# EAGLE design DigitalPSU (EAGLE 7.3.0)
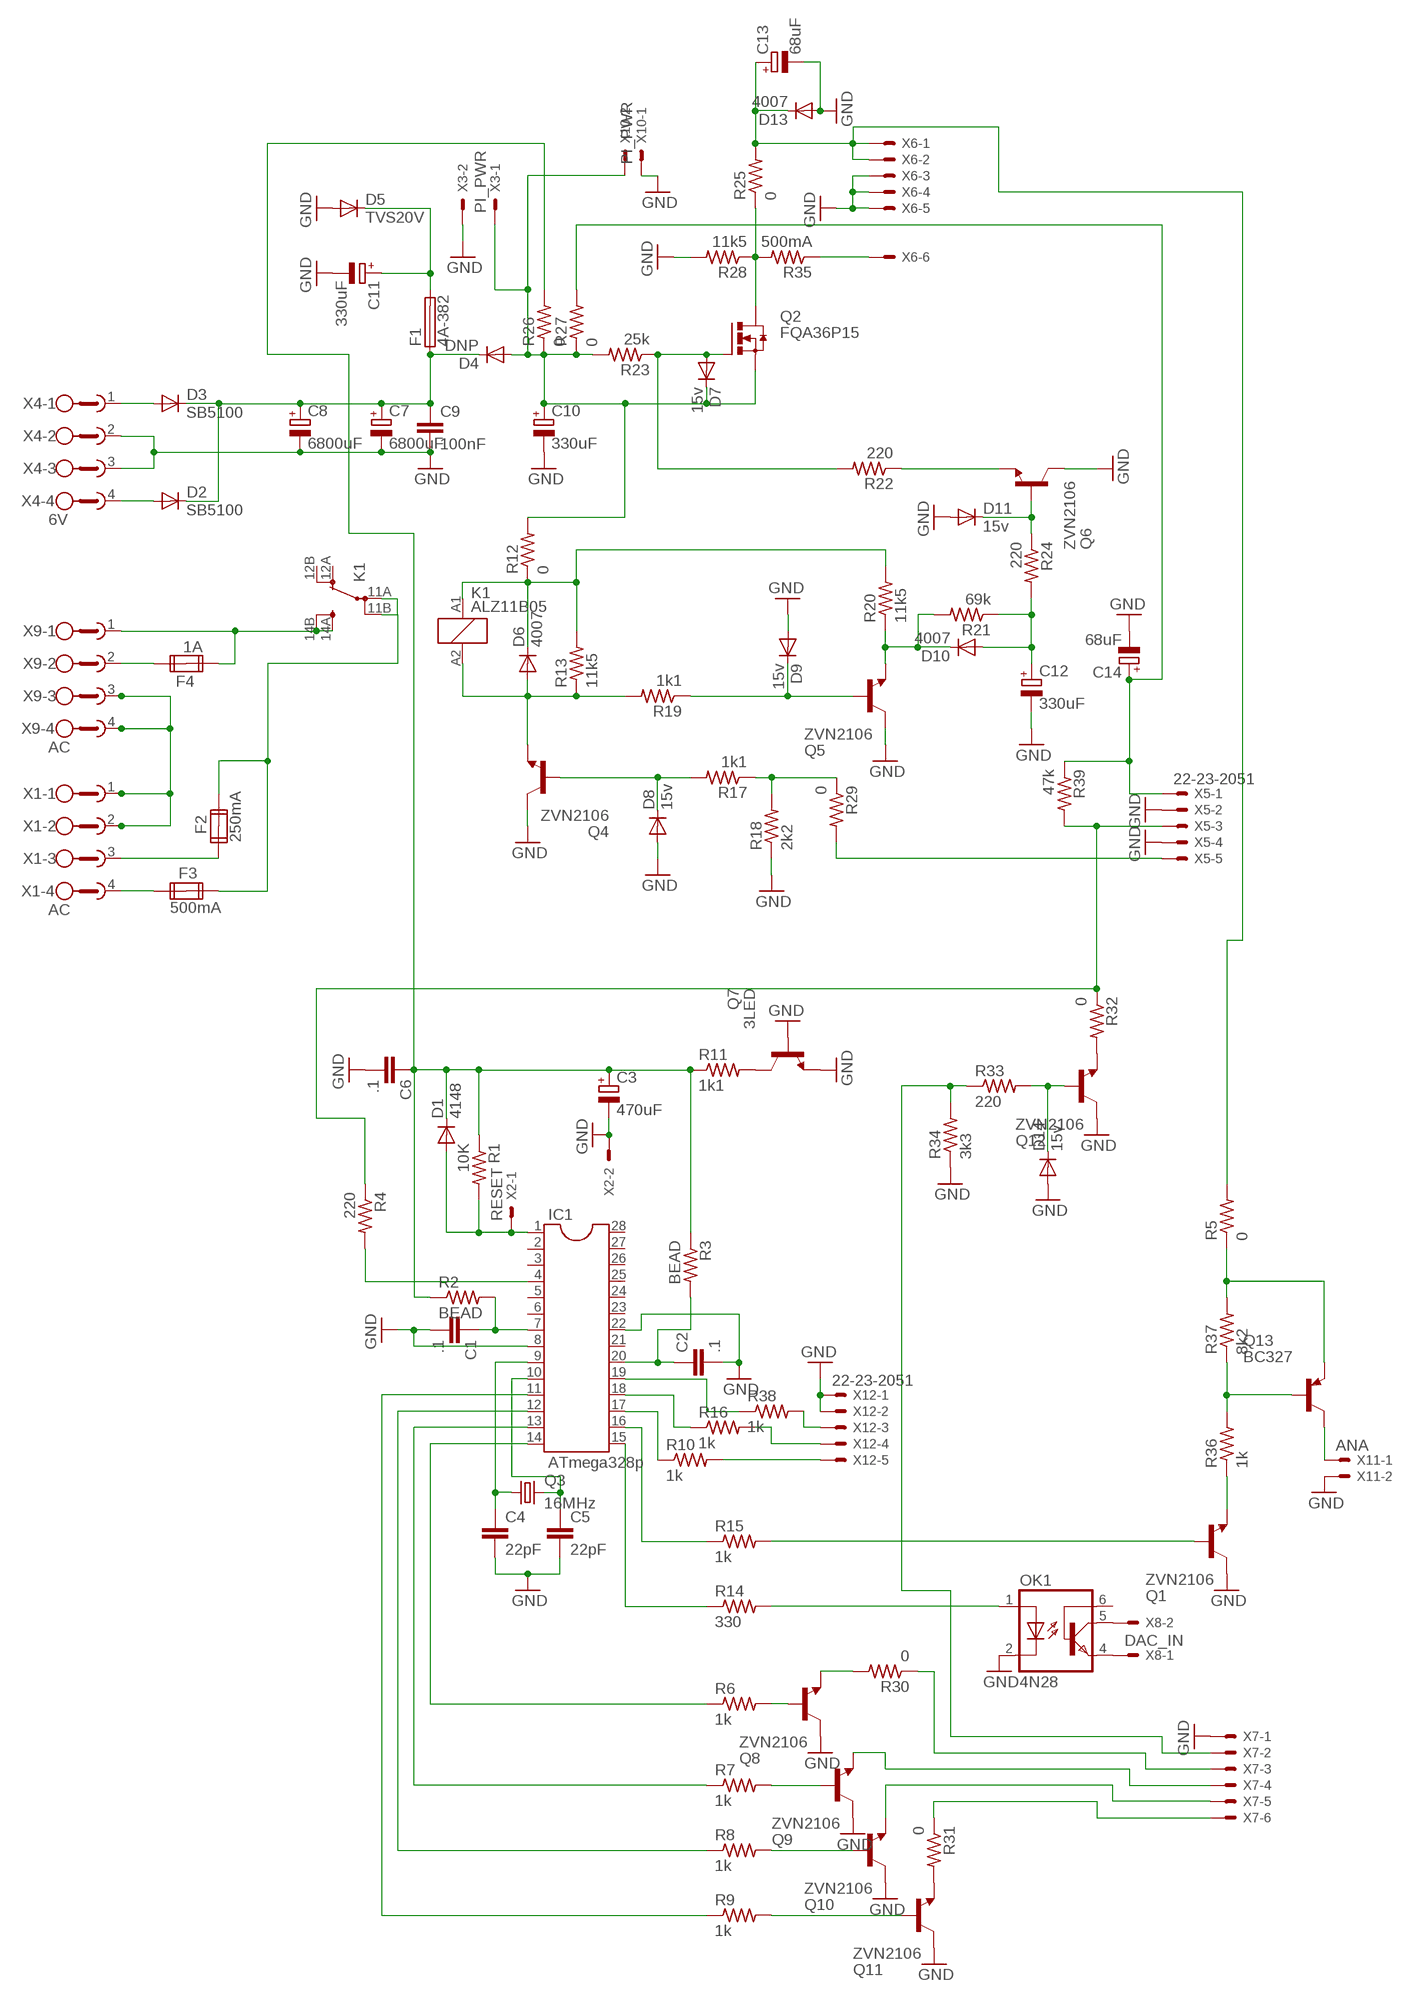
[diagram p0: schematic, sheet 1]

## Parts
C1  .1  C-EUC1210K  [C1210K]
C2  .1  C-EUC1210K  [C1210K]
C3  470uF  CPOL-EUE3.5-10  [E3,5-10]
C4  22pF  C-EUC1210K  [C1210K]
C5  22pF  C-EUC1210K  [C1210K]
C6  .1  C-EUC1210K  [C1210K]
C7  6800uF  CPOL-EUE10-20  [EB20D]
C8  6800uF  CPOL-EUE10-20  [EB20D]
C9  100nF  C10/6  [C10B6]
C10  330uF  CPOL-EUE3.5-10  [E3,5-10]
C11  330uF  CPOL-EUE3.5-10  [E3,5-10]
C12  330uF  CPOL-EUE3.5-10  [E3,5-10]
C13  68uF  CPOL-EUE3.5-10  [E3,5-10]
C14  68uF  CPOL-EUE3.5-10  [E3,5-10]
D1  4148  1N4148DO35-7  [DO35-7]
D2  SB5100  BY448  [SOD57-10]
D3  SB5100  BY448  [SOD57-10]
D4  DNP  1N4004  [DO41-10]
D5  TVS20V  BY448  [SOD57-10]
D6  4007  1N4004  [DO41-10]
D7  15v  1N4148DO35-10  [DO35-10]
D8  15v  1N4148DO35-7  [DO35-7]
D9  15v  1N4148DO35-7  [DO35-7]
D10  4007  1N4148DO35-10  [DO35-10]
D11  15v  1N4148DO35-7  [DO35-7]
D13  4007  1N4004  [DO41-10]
D14  15v  1N4148DO35-7  [DO35-7]
F1  4A-382  19560  [19560]
F2  250mA  FUSE2P  [FUSE1]
F3  500mA  FUSE2P  [FUSE1]
F4  1A  FUSE2P  [FUSE1]
IC1  ATmega328p  DIL28-3  [DIL28-3]
K1  ALZ11B05  RT314730  [RT-C/O16A5]
OK1  4N28  4N35  [DIL06]
Q1  ZVN2106  BC550B  [TO92-EBC]
Q2  FQA36P15  IRFP240  [TO247BV]
Q3  16MHz  CRYSTALHC49S  [HC49/S]
Q4  ZVN2106  BC550B  [TO92-EBC]
Q5  ZVN2106  BC550B  [TO92-EBC]
Q6  ZVN2106  BC550B  [TO92-EBC]
Q7  3LED  BC546A  [TO92-EBC]
Q8  ZVN2106  BC550B  [TO92-EBC]
Q9  ZVN2106  BC550B  [TO92-EBC]
Q10  ZVN2106  BC550B  [TO92-EBC]
Q11  ZVN2106  BC550B  [TO92-EBC]
Q12  ZVN2106  BC550B  [TO92-EBC]
Q13  BC327  BC327-25  [TO92-EBC]
R1  10K  R-US_0309/10  [0309/10]
R2  BEAD  R-US_0309/10  [0309/10]
R3  BEAD  R-US_0309/12  [0309/12]
R4  220  R-US_0309/12  [0309/12]
R5  0  R-US_0309/12  [0309/12]
R6  1k  R-US_R1210  [R1210]
R7  1k  R-US_R1210  [R1210]
R8  1k  R-US_R1210  [R1210]
R9  1k  R-US_R1210  [R1210]
R10  1k  R-US_R1210  [R1210]
R11  1k1  R-US_0309/10  [0309/10]
R12  0  R-US_0309/10  [0309/10]
R13  11k5  R-US_0309/10  [0309/10]
R14  330  R-US_0309/10  [0309/10]
R15  1k  R-US_R1210  [R1210]
R16  1k  R-US_R1210  [R1210]
R17  1k1  R-US_0309/10  [0309/10]
R18  2k2  R-US_0309/10  [0309/10]
R19  1k1  R-US_0309/10  [0309/10]
R20  11k5  R-US_0309/10  [0309/10]
R21  69k  R-US_0309/10  [0309/10]
R22  220  R-US_0309/10  [0309/10]
R23  25k  R-US_0309/10  [0309/10]
R24  220  R-US_0309/10  [0309/10]
R25  0  R-US_0309/12  [0309/12]
R26  0  R-US_0309/12  [0309/12]
R27  0  R-US_0309/12  [0309/12]
R28  11k5  R-US_0204/5  [0204/5]
R29  0  R-US_0309/10  [0309/10]
R30  0  R-US_0309/10  [0309/10]
R31  0  R-US_0309/12  [0309/12]
R32  0  R-US_0309/12  [0309/12]
R33  220  R-US_0309/12  [0309/12]
R34  3k3  R-US_0309/12  [0309/12]
R35  500mA  R-US_0204/5  [0204/5]
R36  1k  R-US_R1210  [R1210]
R37  8k2  R-US_R1210  [R1210]
R38  1k  R-US_R1210  [R1210]
R39  47k  R-US_0309/10  [0309/10]
X1  AC  GMSTBA4  [GMSTBA4]
X2  RESET  22-23-2021  [22-23-2021]
X3  PI_PWR  22-23-2021  [22-23-2021]
X4  6V  GMSTBA4  [GMSTBA4]
X5  22-23-2051  [22-23-2051]
X6  22-23-2061  [22-23-2061]
X7  22-23-2061  [22-23-2061]
X8  DAC_IN  22-23-2021  [22-23-2021]
X9  AC  GMSTBA4  [GMSTBA4]
X10  PI_PWR  22-23-2021  [22-23-2021]
X11  ANA  22-23-2021  [22-23-2021]
X12  22-23-2051  [22-23-2051]

## Nets
GND: C1.2 C2.2 C3.- C4.2 C5.2 C6.2 C7.- C8.- C9.2 C10.- C11.- C12.- C13.- C14.- D5.A D8.A D9.A D11.A D13.A D14.A IC1.8 IC1.22 OK1.2(C) Q1.C Q4.C Q5.C Q6.C Q7.B Q7.E Q8.C Q9.C Q10.C Q11.C Q12.C R18.1 R28.2 R34.1 X2.2 X3.2 X4.2 X4.3 X5.2 X5.4 X6.3 X6.4 X6.5 X7.1 X10.1 X11.2 X12.1 X12.2
N$1: IC1.14 R6.1
N$2: D1.A IC1.1 R1.2 X2.1
N$3: IC1.4 R4.2
N$4: C2.1 IC1.20 R3.2
N$5: R4.1 R32.1 R39.2 X5.3
N$7: IC1.13 R7.1
N$8: IC1.12 R8.1
N$9: C11.+ D5.C F1.2
N$10: IC1.11 R9.1
N$11: IC1.18 R16.1
N$12: C10.+ D4.A D7.C Q2.S R12.2 R23.2 R26.1 R27.1 X3.1 X10.2
N$13: C4.1 IC1.9 Q3.1
N$14: C5.1 IC1.10 Q3.2
N$15: X1.1 X1.2 X9.3 X9.4
N$16: F2.1A X1.3
N$17: F3.1A X1.4
N$18: IC1.15 R14.1
N$19: IC1.16 R15.1
N$20: IC1.17 R10.1
N$21: F4.2A X9.2
N$22: Q7.C R11.2
N$24: F4.1A K1.14A(2:SA) K1.14B(2:SB) X9.1
N$25: F2.2A F3.2A K1.11A(2:PA) K1.11B(2:PB)
N$26: C3.+ C6.1 D1.C R1.1 R2.1 R3.1 R11.1 R26.2
N$27: D3.A X4.1
N$28: D2.A X4.4
N$29: IC1.19 R38.1
N$30: C7.+ C8.+ C9.1 D2.C D3.C D4.C F1.1
N$32: D6.C K1.A1 R12.1 R13.2 R20.2
N$33: D6.A K1.A2 Q4.E R13.1 R19.2
N$34: D7.A Q2.G R22.2 R23.1
N$35: C1.1 IC1.7 R2.2
N$36: D8.C Q4.B R17.2
N$37: R29.2 X5.5
N$38: D9.C Q5.B R19.1
N$39: D10.C Q5.E R20.1 R21.2
N$40: C12.+ D10.A R21.1 R24.2
N$41: R38.2 X12.3
N$42: Q6.E R22.1
N$43: D11.C Q6.B R24.1
N$44: Q2.D R25.1 R28.1 R35.2
N$45: R17.1 R18.2 R29.1
N$46: C14.+ R27.2 R39.1 X5.1
N$47: Q8.B R6.2
N$48: Q9.B R7.2
N$49: Q10.B R8.2
N$50: Q11.B R9.2
N$51: Q8.E R30.2
N$52: Q11.E R31.2
N$53: Q12.E R32.2
N$54: D14.C Q12.B R33.2
N$55: R33.1 R34.2 X7.2
N$56: Q10.E X7.5
N$57: Q9.E X7.4
N$58: R31.1 X7.6
N$59: R35.1 X6.6
N$60: R30.1 X7.3
N$61: C13.+ D13.C R5.2 R25.2 X6.1 X6.2
N$62: OK1.1(A) R14.2
N$63: OK1.4(EMI) X8.1
N$64: OK1.5(COL) X8.2
N$65: Q1.B R15.2
N$66: Q1.E R36.1
N$67: Q13.B R36.2 R37.1
N$68: Q13.E R5.1 R37.2
N$69: R16.2 X12.4
N$70: Q13.C X11.1
N$71: R10.2 X12.5
Unconnected: F2.1B F2.2B F3.1B F3.2B F4.1B F4.2B IC1.2 IC1.3 IC1.5 IC1.6 IC1.21 IC1.23 IC1.24 IC1.25 IC1.26 IC1.27 IC1.28 K1.12A(2:OA) K1.12B(2:OB) OK1.6(BAS)

## Library data of the parts
C1 C2 C4-C6 = resistor:C-EU: CAPACITOR, European symbol
C3 C7 C8 C10-C14 = resistor:CPOL-EU: POLARIZED CAPACITOR, European symbol
C9 = capacitor-wima:C: CAPACITOR naming: grid - package width
D1 D7-D11 D14 = diode:1N4148: DIODE high speed (Philips)
D2 D3 D5 = diode:BY448: DIODE damper diode
D4 D6 D13 = diode:1N4004: DIODE general purpose rectifier, 1 A
F1 = fuse:19560: FUSE HOLDER TR5, Wickmann; MPN: 56000001009; OC_FARNELL: 1185363; OC_NEWARK: 15P8392
F2-F4 = special:FUSE2P: FUSE 5 x 20 mm
IC1 = ic-package:DIL28: Dual In Line
K1 = relay:RT31*: Power PCB Relayl SCHRACK 1 pole 12 / 16 A, DC- or AC-coi Source: http://www.schrack.com/.. 5819.pdf; MPN: RT314730; OC_FARNELL: 1629051; OC_NEWARK: 03P2424
OK1 = optocoupler:4N35: MOTOROLA OPTO COUPLER; MF: FAIRCHILD SEMICONDUCTOR; MPN: 4N35; OC_FARNELL: 1328375; OC_NEWARK: 72K9946
Q1 Q4-Q6 Q8-Q12 = transistor-npn:BC550*: NPN Transistor
Q2 = transistor-power:IRFP240: HEXFET Power MosFet Source: http://www.irf.com/
Q3 = crystal:CRYSTAL: CRYSTAL; OC_FARNELL: 1667008; OC_NEWARK: unknown
Q7 = transistor-npn:BC546*: NPN Transistor
Q13 = transistor-pnp:BC327*: PNP Transistror
R1-R39 = resistor:R-US_: RESISTOR, American symbol
X1 X4 X9 = con-phoenix-762:GMSTBA4: PHOENIX; MF: FARNELL; MPN: 1757268; OC_FARNELL: 3705195; OC_NEWARK: 71C4163
X2 X3 X8 X10 X11 = con-molex:22-23-2021: .100" (2.54mm) Center Header - 2 Pin; MF: MOLEX; MPN: 22-23-2021; OC_FARNELL: 1462926; OC_NEWARK: 25C3832
X5 X12 = con-molex:22-23-2051: .100" (2.54mm) Center Header - 5 Pin; MF: MOLEX; MPN: 22-23-2051; OC_FARNELL: 1462952; OC_NEWARK: 38C9178
X6 X7 = con-molex:22-23-2061: .100" (2.54mm) Center Header - 6 Pin; MF: MOLEX; MPN: 22-23-2061; OC_FARNELL: 1462922; OC_NEWARK: 27C1933

## Board
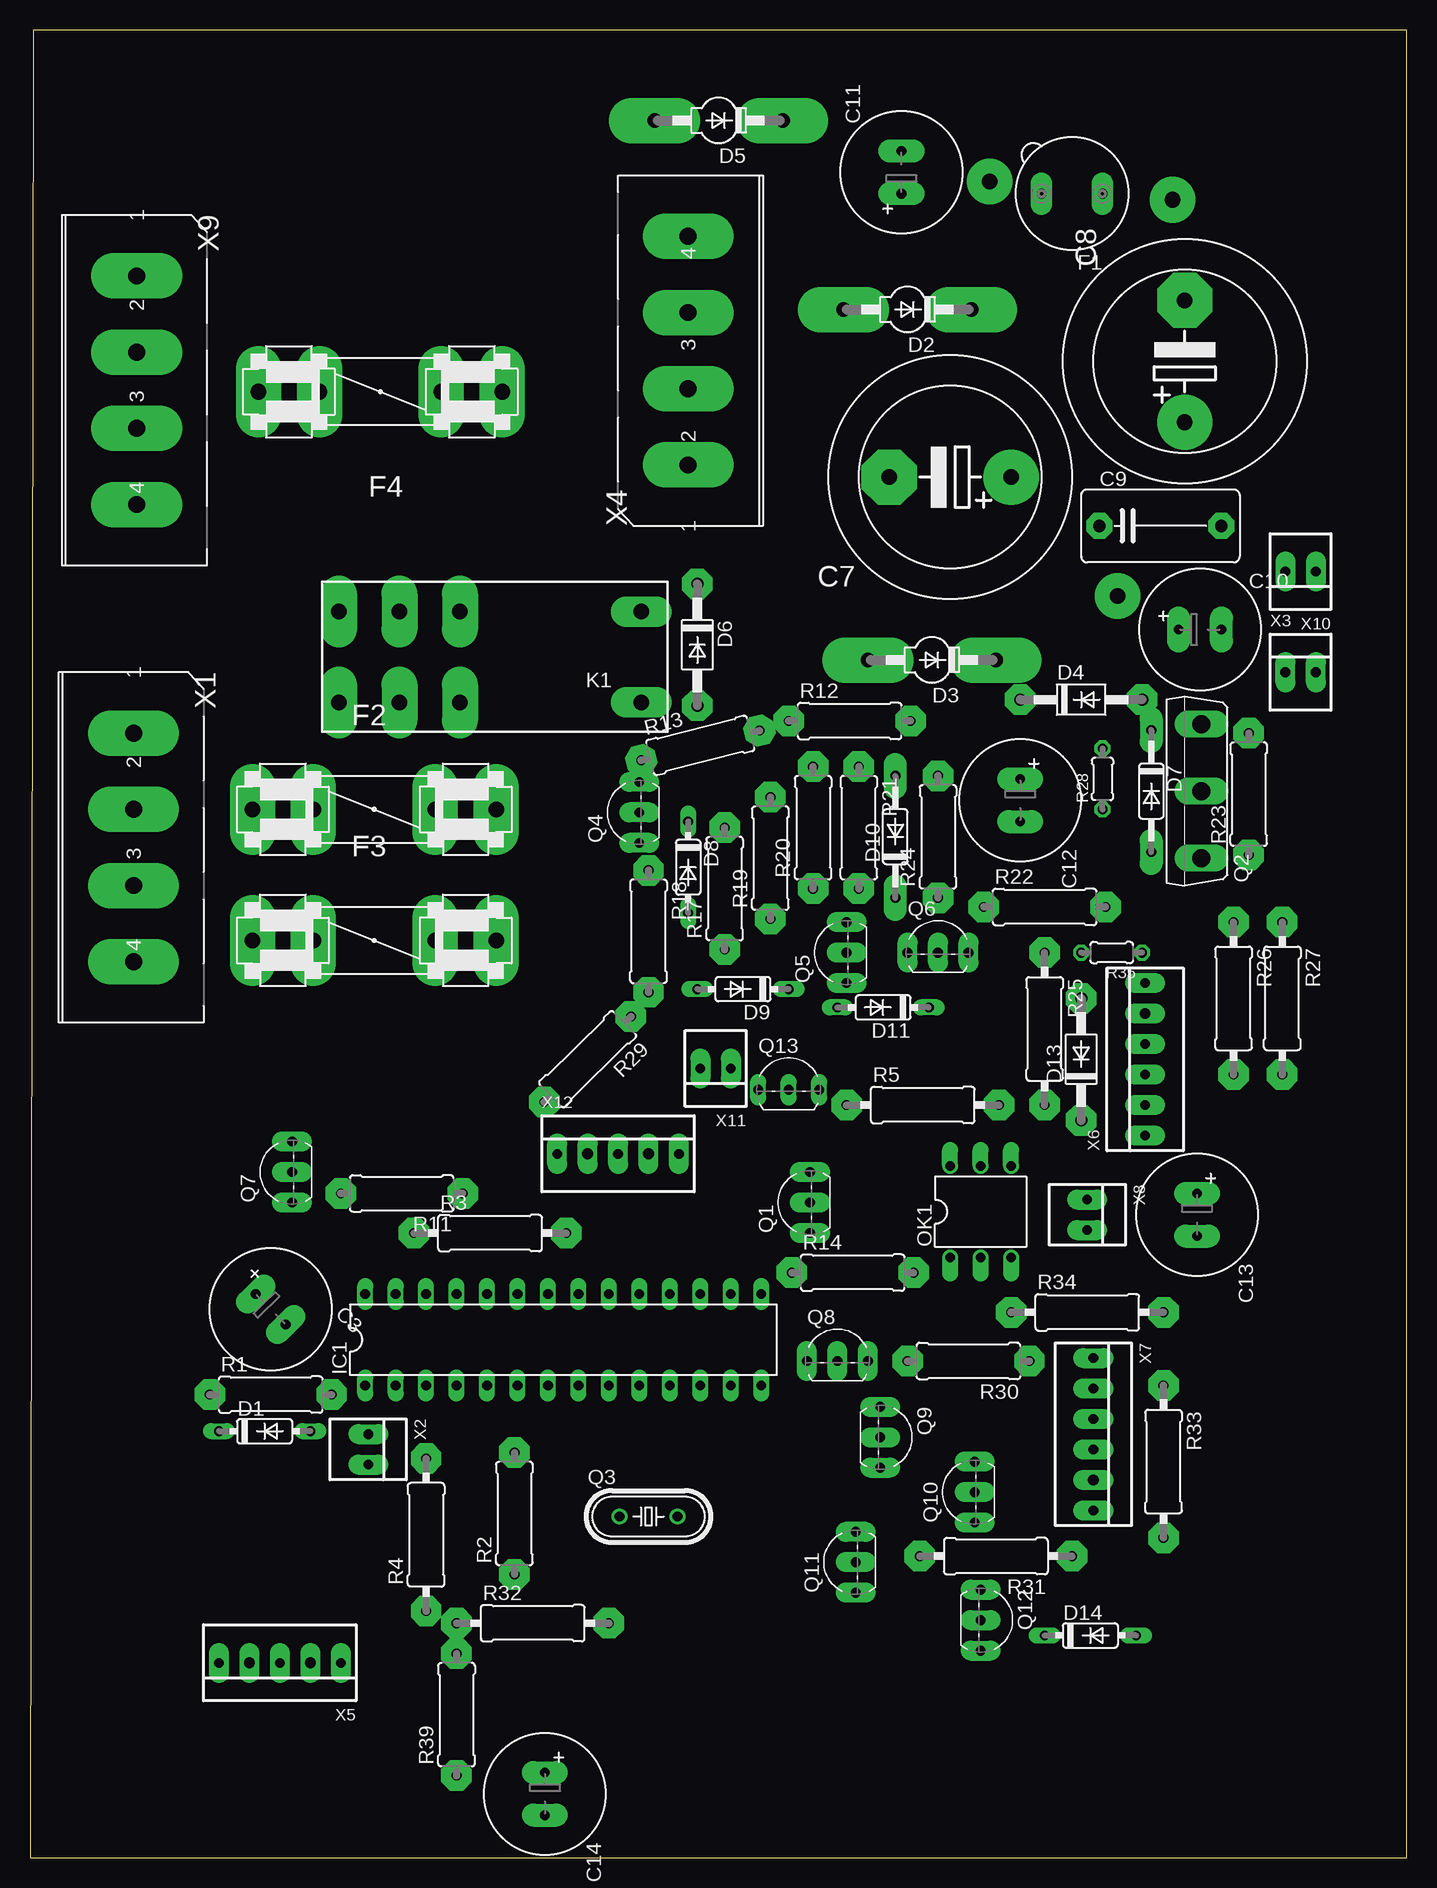
[diagram p1: board, top side]
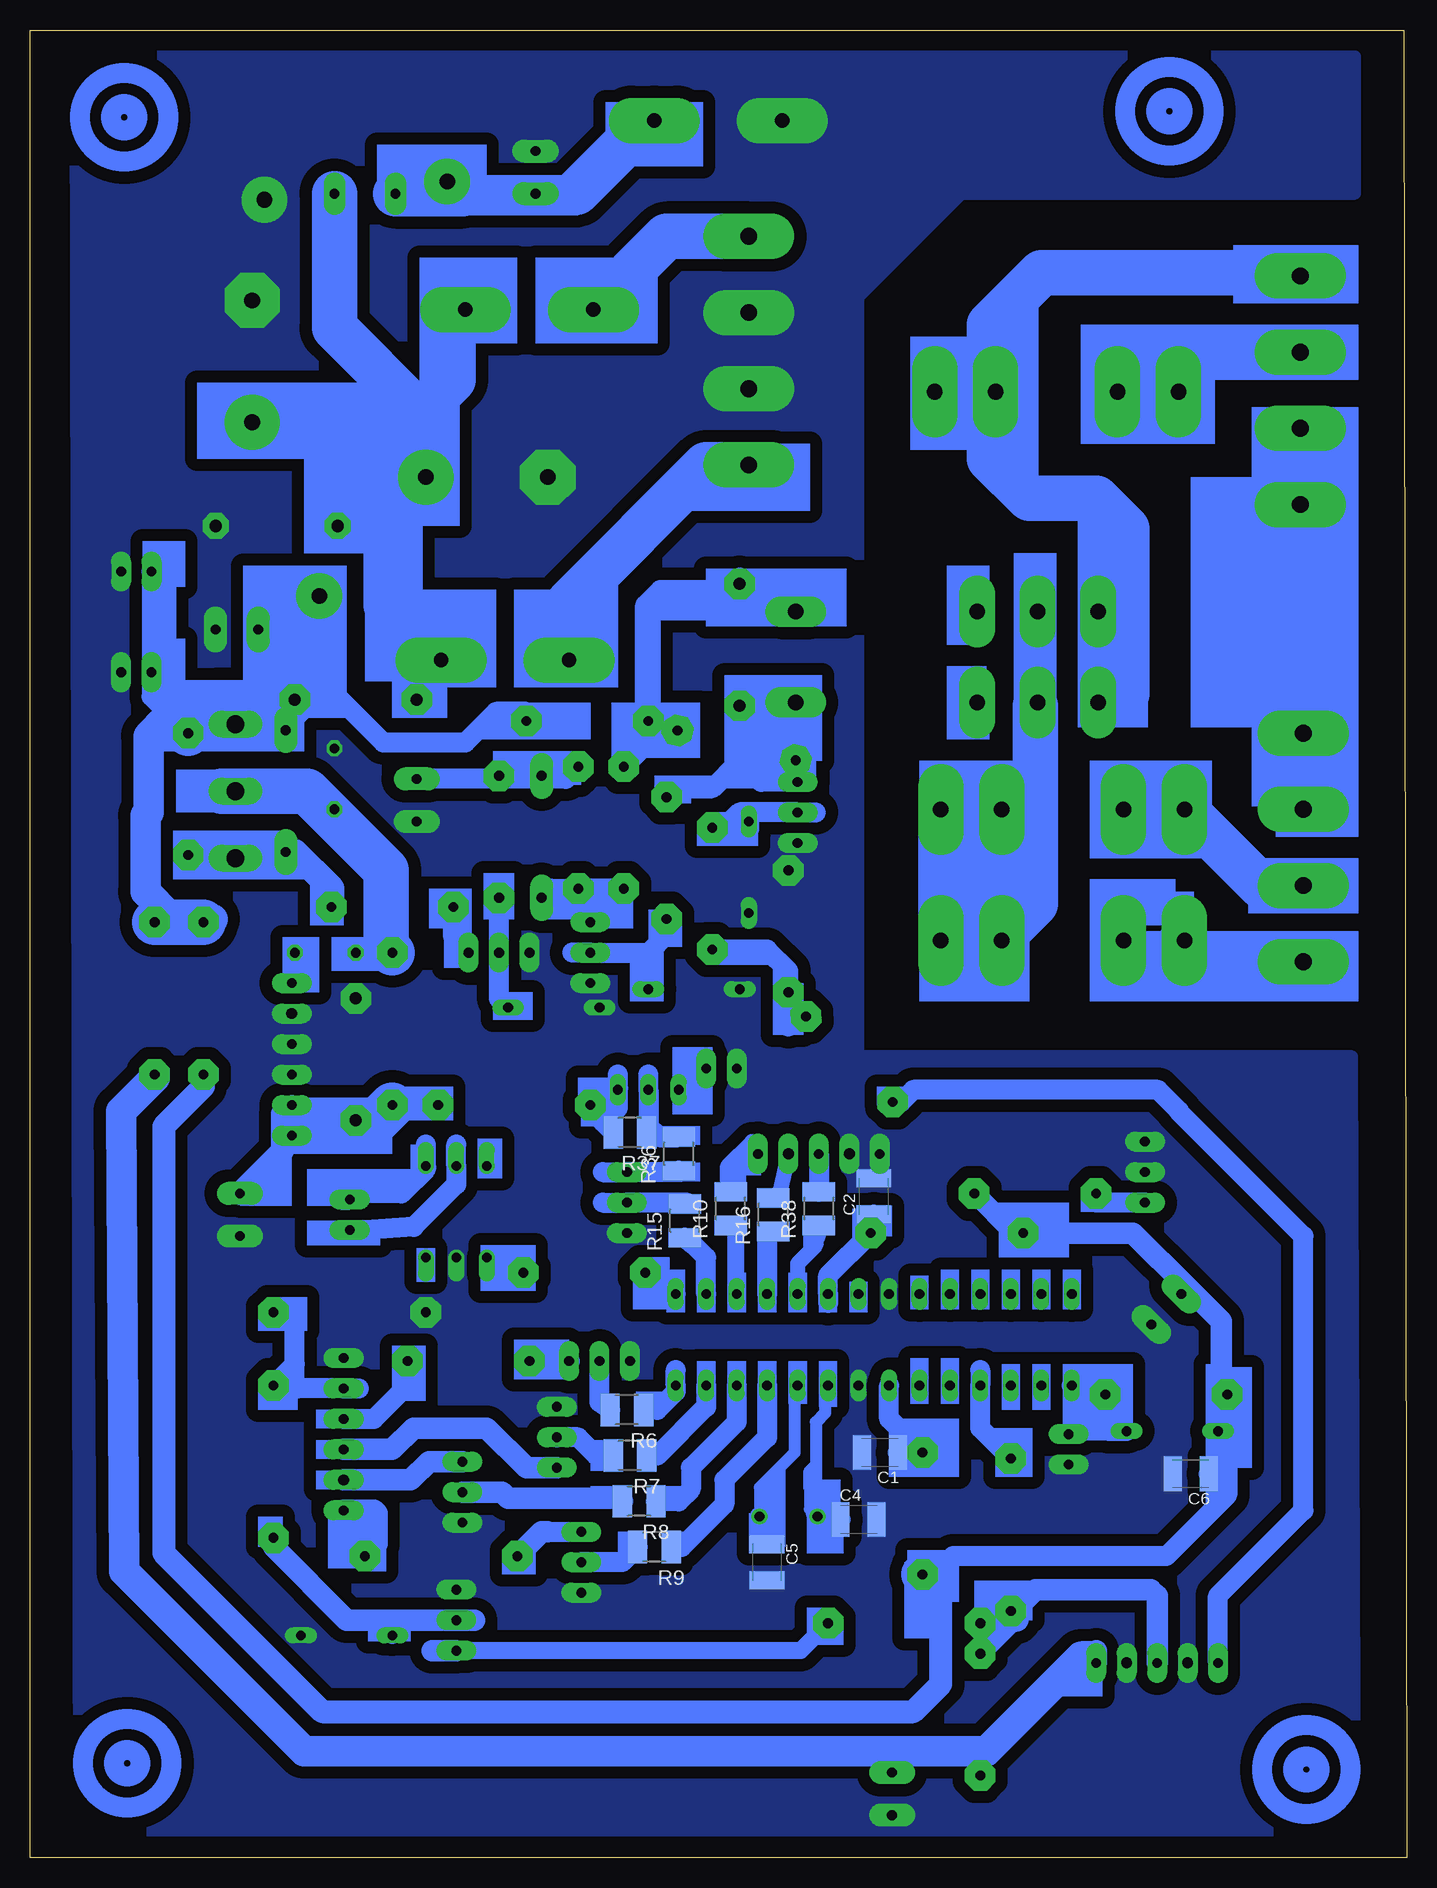
[diagram p2: board, bottom side, seen from below]

Size 114.79 x 152.32 mm. Coordinates in mm from the lower left corner, seen from the top.
Outline: 0,0 114.79,0 114.79,152.32 0.25,152.32 0,0
Copper layers (1*16): Top 0.035mm / dielectric 1.5mm / Bottom 0.035mm
Design rules "default": minimum track width 10mil, minimum drill 24mil, track to track 8mil, track to pad 8mil, pad to pad 8mil, via to via 8mil, smd to smd 8mil, copper to edge 40mil, drill to drill 8mil, minimum pad ring 10mil, minimum via ring 8mil, stop-mask expansion 4mil, vias tented up to drill 0mil, thermal gap 10mil

### Footprints (pad centres in the part's own frame; a part is rotated, then mirrored left to right if it is on the bottom)
C1210K = smd 1.5 x 2.9: 1 -1.5,0; 2 1.5,0
E3,5-10 = drill 0.813 pad 1.93 long: + -1.778,0; - 1.778,0
EB20D = drill 1.3 pad 4.597: + -5.08,0 | drill 1.3 pad 4.597 octagon: - 5.08,0
C10B6 = drill 1.016 pad 2.159 octagon: 1 -5.08,0; 2 5.08,0
DO35-7 = drill 0.813 long: A 3.81,0; C -3.81,0
SOD57-10 = drill 1.194 pad 3.81 long: A 5.334,0; C -5.334,0
DO41-10 = drill 1 pad 2.54 octagon: A 5.08,0; C -5.08,0
DO35-10 = drill 0.813 pad 1.93 long: A 5.08,0; C -5.08,0
19560 = drill 0.813 pad 1.778 long: 1 -2.54,0; 2 2.54,0
FUSE1 = drill 1.3 pad 3.81 long: 1A -10.16,0; 1B -5.08,0; 2A 10.16,0; 2B 5.08,0
DIL28-3 = drill 0.813 long: 1 -16.51,-3.81; 2 -13.97,-3.81; 3 -11.43,-3.81; 4 -8.89,-3.81; 5 -6.35,-3.81; 6 -3.81,-3.81; 7 -1.27,-3.81; 8 1.27,-3.81; 9 3.81,-3.81; 10 6.35,-3.81; 11 8.89,-3.81; 12 11.43,-3.81; 13 13.97,-3.81; 14 16.51,-3.81; 15 16.51,3.81; 16 13.97,3.81; 17 11.43,3.81; 18 8.89,3.81; 19 6.35,3.81; 20 3.81,3.81; 21 1.27,3.81; 22 -1.27,3.81; 23 -3.81,3.81; 24 -6.35,3.81; 25 -8.89,3.81; 26 -11.43,3.81; 27 -13.97,3.81; 28 -16.51,3.81
RT-C/O16A5 = drill 1.3 pad 3 long: 11A 7.56,3.78; 11B 7.56,-3.78; 12A 2.52,3.78; 12B 2.52,-3.78; 14A 12.6,3.78; 14B 12.6,-3.78 | drill 1.3 pad 2.54 long: A1 -12.6,-3.78; A2 -12.6,3.78
DIL06 = drill 0.813 offset: 1 -2.54,-3.81; 2 0,-3.81; 3 2.54,-3.81; 4 2.54,3.81; 5 0,3.81; 6 -2.54,3.81
TO92-EBC = drill 0.813 pad 1.676 long: B 0,-1.27; C -2.54,-1.27; E 2.54,-1.27
TO247BV = drill 1.499 long: D 0,-2.921; G -5.588,-2.921; S 5.588,-2.921
HC49/S = drill 0.813: 1 -2.413,0; 2 2.413,0
TO92-EBC' = drill 0.813 long: B 0,-1.27; C -2.54,-1.27; E 2.54,-1.27
0309/10 = drill 0.813 pad 2.54 octagon: 1 -5.08,0; 2 5.08,0
0309/12 = drill 0.813 pad 2.54 octagon: 1 -6.35,0; 2 6.35,0
R1210 = smd 1.6 x 2.7: 1 -1.4,0; 2 1.4,0
0204/5 = drill 0.813 octagon: 1 -2.54,0; 2 2.54,0
GMSTBA4 = drill 1.397 pad 3.81 long: 1 -8.89,5.08; 2 -2.54,5.08; 3 3.81,5.08; 4 10.16,5.08
22-23-2021 = drill 0.8 pad 1.676 long: 1 -1.27,0; 2 1.27,0
22-23-2051 = drill 0.8 pad 1.676 long: 1 -5.08,0; 3 0,0; 5 5.08,0 | drill 0.9 pad 1.676 long: 2 -2.54,0; 4 2.54,0
22-23-2061 = drill 0.8 pad 1.676 long: 1 -6.35,0; 2 -3.81,0; 3 -1.27,0; 4 1.27,0; 6 6.35,0 | drill 0.9 pad 1.676 long: 5 3.81,0

### Placement (x,y rotation side)
C1  43.94,33.78 180 bottom
C2  44.45,55.12 90 bottom
C3  20.07,45.72 314.6 top
C4  45.72,28.19 0 bottom
C5  53.34,24.64 270 bottom
C6  18.03,32 180 bottom
C7  76.71,115.06 180 top
C8  96.27,124.71 90 top
C9  94.23,111 0 top
C10  97.54,102.36 0 top
C11  72.64,140.46 90 top
C12  82.55,88.14 270 top
C13  97.28,53.59 270 top
C14  42.93,5.33 270 top
D1  19.56,35.56 0 top
D2  73.15,129.03 180 top
D3  75.18,99.82 180 top
D4  87.63,96.52 0 top
D5  57.4,144.78 180 top
D6  55.63,101.09 270 top
D7  93.47,88.9 270 top
D8  54.86,82.55 270 top
D9  59.44,72.39 180 top
D10  72.14,85.09 90 top
D11  71.12,70.87 180 top
D13  87.63,66.55 90 top
D14  88.39,18.54 0 top
F1  86.87,138.68 180 top
F2  28.7,87.38 0 top
F3  28.7,76.45 0 top
F4  29.21,122.17 180 top
IC1  44.45,43.18 0 top
K1  38.35,100.08 180 top
OK1  79.25,53.85 0 top
Q1  63.75,54.61 90 top
Q2  94.74,88.9 90 top
Q3  51.56,28.45 0 top
Q4  49.53,87.12 90 top
Q5  66.8,75.44 90 top
Q6  75.69,76.71 0 top
Q7  20.57,57.15 90 top
Q8  67.31,42.67 0 top
Q9  72.14,35.05 270 top
Q10  77.47,30.48 90 top
Q11  67.56,24.64 90 top
Q12  80.52,19.81 270 top
Q13  BC327  [TO92-EBC']  63.25,65.28 0 top
R1  20.07,38.61 0 top
R2  40.39,28.7 90 top
R3  38.35,52.07 0 top
R4  33.02,26.92 90 top
R5  74.42,62.74 0 top
R6  65.02,37.34 180 bottom
R7  64.77,33.53 180 bottom
R8  64.01,29.72 180 bottom
R9  62.74,25.91 180 bottom
R10  56.39,54.1 90 bottom
R11  30.99,55.37 180 top
R12  68.33,94.74 0 top
R13  55.88,92.71 14.1 top
R14  68.58,48.77 0 top
R15  60.2,53.09 90 bottom
R16  52.83,53.59 90 bottom
R17  57.91,80.77 90 top
R18  51.56,77.22 270 top
R19  61.72,83.31 90 top
R20  65.28,85.85 90 top
R21  69.09,85.85 270 top
R22  84.58,79.25 0 top
R23  101.6,88.65 90 top
R24  75.69,85.09 90 top
R25  84.58,69.09 270 top
R26  100.33,71.63 270 top
R27  104.39,71.63 270 top
R28  89.41,89.92 90 top
R29  46.48,66.55 224.6 top
R30  78.23,41.4 180 top
R31  80.52,25.15 180 top
R32  41.91,19.56 0 top
R33  94.49,33.02 270 top
R34  88.14,45.47 0 top
R35  90.17,75.44 180 top
R36  60.71,58.67 90 bottom
R37  64.77,60.45 180 bottom
R38  49.02,54.1 90 bottom
R39  35.56,11.94 90 top
X1  3.56,84.84 270 top
X2  28.19,34.04 270 top
X3  105.92,98.81 0 top
X4  59.94,124.97 90 top
X5  20.83,16.26 180 top
X6  92.96,66.55 90 top
X7  88.65,35.31 270 top
X8  88.14,53.59 270 top
X9  3.81,122.94 270 top
X10  105.92,107.19 180 top
X11  57.15,65.79 180 top
X12  49.02,58.67 0 top

### Tracks (layer width: path | path; a pad name or v marks a point on that pad's centre or on a via)
GND  (via drill 1.3 pad 3.81)
  other vias: 95.25,138.18
  pour Bottom (isolate 1.016, no thermals): 4.57,66.8 45.72,66.8 45.72,130.05 37.08,138.68 4.32,138.68 4.32,150.11 111,150.11 110.74,2.29 4.32,2.29
N$1
  Bottom 1.676: 60.96,40.64 IC1.14 60.96,38.86 62.48,37.34 R6.1
N$2
  Bottom 1.676: R1.2 25.91,39.37 27.18,39.37 | 27.18,39.37 IC1.1 | X2.1 27.18,35.81 27.18,37.85 | 27.18,37.85 27.18,39.37 | D1.A 24.89,35.56 27.18,37.85
N$3
  Bottom 1.676: R4.2 35.56,35.81 IC1.4 35.56,40.64
N$4
  Bottom 1.676: 48.26,46.23 IC1.20 48.26,48.51 R3.2 C2.1
N$5
  Bottom 1.676: R39.2 32.77,19.81 32.77,20.07
  Bottom 1.778: X5.3 20.83,21.84 21.34,22.35 30.99,22.35 32.77,20.57 R4.1
  Bottom 1.93: R32.1 35.31,19.81 32.51,19.81 32.77,20.07 33.02,20.32 R4.1
N$6
  Bottom 1.676: 15.49,39.12 15.49,39.37
N$7
  Bottom 1.676: IC1.13 58.42,37.59 62.48,33.53 R7.1
N$8
  Bottom 1.676: IC1.12 55.88,36.32 59.69,32.51 59.69,30.73 60.71,29.72 R8.1
N$9
  Bottom 1.676: 78.74,138.68 C11.+
  Bottom 1.93: 68.58,139.45 69.22,138.81 69.34,138.68 C11.+
  Bottom 3.81: F1.2 78.74,138.68 | D5.C 64.52,143.51 69.22,138.81
N$10
  Bottom 1.676: IC1.11 53.34,35.05 56.9,31.5 56.9,29.46 60.45,25.91 R9.1
N$11
  Bottom 1.676: R16.1 53.34,51.69 IC1.18
N$12  (via drill 1.3 pad 3.81)
  Bottom 1.676: v90.68,105.16 92.2,104.65 | 92.2,104.65 94.49,104.65 C10.+ | 92.2,104.65 93.22,103.63 D4.A 92.2,97.03 92.2,99.82 85.34,92.96 78.49,92.96 75.95,95.5 73.41,95.5 R12.2 | D7.C 92.46,95.5 93.34,95.38 93.34,95.89 | 103.5,94.87 103.5,95.63 104.65,96.77 X3.1 X10.2
  Bottom 2.54: R23.2 102.36,94.49 102.36,96.01 103.5,94.87 104.9,93.47 104.9,87.12 105.16,86.87 105.16,80.52 103.12,78.49 99.57,78.23 R26.1
  Bottom 3.81: D4.A 93.22,96.01 | 93.22,96.01 93.34,95.89 94.74,94.49 Q2.S 98.81,94.49 | R23.2 99.06,96.27 | 99.06,96.27 93.47,96.27 93.22,96.01 | R26.1 R27.1 | 102.36,96.27 99.06,96.27
N$13
  Bottom 1.016: IC1.9 48.51,39.12 48.51,37.08 49.28,36.32 49.28,32.77 49.78,32.26 49.78,29.08 Q3.1
  Bottom 1.676: 49.28,28.73 C4.1 49,28.3 Q3.1
N$14
  Bottom 1.016: IC1.10 51.05,39.37 51.05,33.78 53.95,30.88 53.95,27.95 | 52.32,30.1 Q3.2 | C5.1 53.93,26.22 53.93,27.44
  Bottom 1.676: Q3.2 53.95,27.95 53.93,27.44
N$15
  Bottom 1.676: X9.3 X9.4 | X9.4 8.64,110.74 8.89,110.49 X9.4 | X1.2 X1.1 X9.4
N$16
  Bottom 3.81: X1.3 12.19,81.03 F2.1A
N$17
  Bottom 3.81: X1.4 17.02,74.68 18.8,76.45 F3.1A
N$18
  Bottom 1.676: IC1.15 62.74,48.77
  Bottom 1.778: 62.74,48.77 R14.1
N$19
  Bottom 1.676: IC1.16 58.42,50.04 59.44,51.05 R15.1
N$20
  Bottom 1.27: R10.1 55.88,52.19 IC1.17
N$21
  Bottom 3.81: F4.2A 20.07,122.17 | 24.13,122.17 20.07,122.17 | 20.07,122.17 16.76,125.48 X9.2
N$22
  Bottom 1.676: Q7.C 25.91,54.61 R11.2
N$24
  Bottom 1.676: 23.37,97.03 22.45,97.64 K1.14A | K1.14B 22.35,105.53 22.35,105.41 23.37,108.71
  Bottom 3.81: X9.1 10.67,132.08 30.48,132.08 34.8,127.76 34.8,122.43 | 34.8,122.43 34.8,116.59 31.5,113.28 25.91,113.28 23.37,110.74 23.37,108.71 23.37,97.03 | F4.1A 39.12,122.43 34.8,122.43
N$25
  Bottom 2.184: K1.11B K1.11A 30.99,98.78 30.99,96.01
  Bottom 3.81: 30.99,96.01 30.99,79.5 34.04,76.45 F3.2A F2.2A
N$26
  Bottom 1.676: 32,52.32 R3.1 32.77,52.07 R11.1 | C6.1 14.96,35.56 D1.C 14.99,34.8 14.99,30.23 20.07,25.15 37.85,25.15 38.86,24.13 39.37,23.62 R2.1
  Bottom 1.778: 14.96,35.56 14.99,35.58 R1.1 15.49,39.12 15.49,44.7 18.29,47.5 | 18.29,47.5 22.86,52.07 R3.1 | C3.+ 18.31,47.5 18.29,47.5
  Bottom 1.93: 38.86,24.13 38.86,14.48 41.15,12.19 90.42,12.19 103.63,25.4 103.63,60.96 100.33,64.26 R26.2
N$27
  Bottom 3.81: D3.A 69.85,104.65 58.42,116.08 X4.1
N$28
  Bottom 3.81: X4.4 61.72,135.13 D2.A
N$29
  Bottom 1.27: 49.28,51.82 49.28,51.05 50.8,49.53 IC1.19
  Bottom 1.676: R38.1 49.28,52.45 49.28,51.82
N$30
  Bottom 1.676: 86.11,111 85.09,112.01 | 89.15,112.78 84.07,112.78 C7.+ | D4.C 83.06,97.28 D3.C
  Bottom 3.81: D2.C 79.5,128.02 79.5,123.19 84.2,118.49 | C7.+ 81.79,120.65 82.55,120.65 | C8.+ 94.49,120.65 85.09,120.65 | 85.09,120.65 82.55,120.65 | 85.09,117.6 85.09,112.01 85.09,104.39 D3.C | 85.09,117.6 85.09,120.65 | 84.2,118.49 85.09,117.6 | F1.1 89.41,127.51 82.55,120.65 | C9.1 83.82,116.33 83.82,118.11 84.2,118.49
N$31  (via drill 1.3 pad 3.81)
  other vias: 80.01,139.7
N$32
  Bottom 1.676: 55.63,105.66 62.23,105.66 63.5,104.39 63.5,95.76 R12.1 62.48,94.74 62.1,94.36 | 55.63,105.66 52.58,105.66 51.79,104.87 K1.A1 | 55.63,106.68 D6.C 55.63,105.66 | R13.2 62.1,94.36 | R20.2 62.1,94.11 62.1,94.36
N$33
  Bottom 1.676: R13.1 50.95,93.37 K1.A2 50.58,97.31 50.55,97.28 54.61,97.28 D6.A 55.63,91.44 | R19.2 60.96,89.15 57.91,89.15 55.63,91.44 | Q4.E 53.85,89.66 55.63,91.44
N$34
  Bottom 2.184: R22.2 89.66,80.77 92.71,83.82 D7.A
  Bottom 2.54: 93.73,83.31 93.98,83.31 | 93.98,83.31 Q2.G 101.35,83.31 R23.1 | D7.A 93.98,83.31
N$35
  Bottom 1.676: C1.1 R2.2 | 38.58,33.78 R2.2 | R2.2 43.18,36.58 IC1.7
N$36
  Bottom 1.676: 49.28,87.12 Q4.B 54.86,87.12 | 54.86,87.12 55.63,87.12 56.9,85.85 R17.2 | 54.86,85.6 D8.C 54.86,87.12
N$37
  Bottom 1.676: X5.5 15.75,21.84 8.64,28.96 8.64,51.82 19.05,62.23 18.98,62.23 20.76,64.01 41.15,64.01 42.18,62.98 R29.2
N$38
  Bottom 1.676: 69.6,75.44 Q5.B 63.25,75.44 | 63.25,75.44 61.72,76.96 R19.1 | D9.C 63.25,75.44
N$39
  Bottom 1.676: R20.1 67.82,80.77 | 67.82,80.77 R21.2 71.37,80.77 D10.C | Q5.E 67.82,78.23 67.82,80.77
N$40
  Bottom 1.676: R21.1 70.1,89.92 71.63,89.92 71.88,89.92 | 71.88,89.92 75.69,89.92 | 75.69,89.92 C12.+ | R24.2 75.69,89.92 | D10.A 71.88,89.92
N$41
  Bottom 1.676: X12.3 R38.2
N$42
  Bottom 1.676: Q6.E 79.5,76.71 R22.1
N$43
  Bottom 1.676: R24.1 Q6.B 75.69,71.63 D11.C
N$44
  Bottom 1.676: R28.1 90.3,88.27 91.06,88.27 | R35.2 R25.1
  Bottom 3.81: 98.81,88.9 Q2.D 91.69,88.9 91.06,88.27 85.09,82.3 85.09,75.95 R25.1
N$45
  Bottom 1.676: R17.1 53.34,75.69 51.56,73.91 R18.2 51.56,69.29 R29.1
N$46
  Bottom 1.422: C14.+ 42.93,8.89
  Bottom 1.676: R39.1 35.56,8.89
  Bottom 1.778: 25.91,17.27 X5.1 25.91,17.02 26.16,16.76 27.18,16.76
  Bottom 2.54: R27.2 104.39,65.02 107.19,62.23 106.93,23.88 91.95,8.89 42.93,8.89 35.56,8.89 35.05,8.89 27.18,16.76
N$47
  Bottom 1.676: R6.2 67.31,37.97 Q8.B
N$48
  Bottom 1.676: R7.2 67.56,33.53 69.09,35.05 Q9.B
N$49
  Bottom 1.778: R8.2 65.66,29.97 74.93,29.97 75.44,30.48 Q10.B
N$50
  Bottom 1.676: R9.2 65.41,24.64 Q11.B
N$51
  Bottom 1.778: Q8.E R30.2
N$52
  Bottom 1.676: 71.63,27.18 Q11.E
  Bottom 1.778: R31.2 72.14,27.18 71.63,27.18
N$53
  Bottom 1.422: R32.2 50.55,17.27 79.76,17.27
  Bottom 1.778: Q12.E 79.76,17.27 81.28,17.27
N$54
  Bottom 1.422: D14.C 84.84,19.81
  Bottom 1.778: 77.72,19.81 Q12.B 84.84,19.81 88.39,19.81 94.49,25.91 R33.2
N$55
  Bottom 1.676: 87.38,39.12 X7.2 92.46,39.12 92.71,39.37 R33.1 92.71,41.15 92.71,45.21 92.96,45.47 R34.2
N$56
  Bottom 1.778: Q10.E 81.53,33.02 83.06,31.5 X7.5
N$57
  Bottom 1.778: Q9.E 73.41,32.51 76.71,35.81 82.8,35.81 84.58,34.04 X7.4
N$58
  Bottom 1.778: R31.1 85.85,26.16 85.85,28.7 86.11,28.96 X7.6
N$59
  Bottom 1.676: X6.6 92.71,73.15 R35.1
N$60
  Bottom 1.676: X7.3 86.11,36.58 83.31,39.37 R30.1
N$61
  Bottom 1.676: R5.2 R25.2 | 91.95,61.47 92.96,62.48 | 92.96,62.48 X6.2 | 92.71,60.2 X6.1 93.73,60.2 | 92.96,62.48 93.47,61.98 93.73,61.98
  Bottom 1.93: C13.+ 93.73,58.93 93.73,60.2 93.73,61.98
  Bottom 3.81: R25.2 85.85,61.47 D13.C 91.95,61.47
N$62
  Bottom 0.813: 75.44,48.77 OK1.1
  Bottom 1.676: 75.44,48.77 R14.2
N$63
  Bottom 1.676: 81.79,59.44 OK1.4 81.79,57.4 83.82,55.37 87.63,55.37 X8.1 88.9,54.86
N$64
  Bottom 1.676: 79.25,59.44 OK1.5 79.25,56.13 82.8,52.58 86.87,52.32 X8.2
N$65
  Bottom 1.676: R15.2 60.07,54.61 Q1.B 67.06,54.61
N$66
  Bottom 1.676: R36.1 60.58,57.15 Q1.E 67.06,57.15
N$67
  Bottom 1.676: 63.25,65.28 Q13.B 63.25,60.96 62.87,60.58 | 62.87,60.58 62.36,60.07 R36.2 | R37.1 63.24,60.58 62.87,60.58
N$68
  Bottom 1.676: R37.2 67.06,61.34 67.06,62.99 65.79,64.26 | 65.79,64.26 65.79,65.28 | 65.79,64.26 Q13.E 65.79,62.48 66.04,62.23 68.07,62.23 R5.1
N$69
  Bottom 1.27: X12.4 52.32,55.37
  Bottom 1.422: 52.32,55.37 R16.2
N$70
  Bottom 1.27: Q13.C 59.44,65.28
  Bottom 1.676: 59.44,65.28 X11.1
N$71
  Bottom 1.27: R10.2 56.39,56.13 56.64,56.39 56.64,57.66 54.61,59.69 54.1,59.69 X12.5
(copper drawn outside any net)
  shapes: Bottom area x349, Bottom circle x12